# Altium schematic sheet Output_Distribution.SchDoc (part 2 of 3)
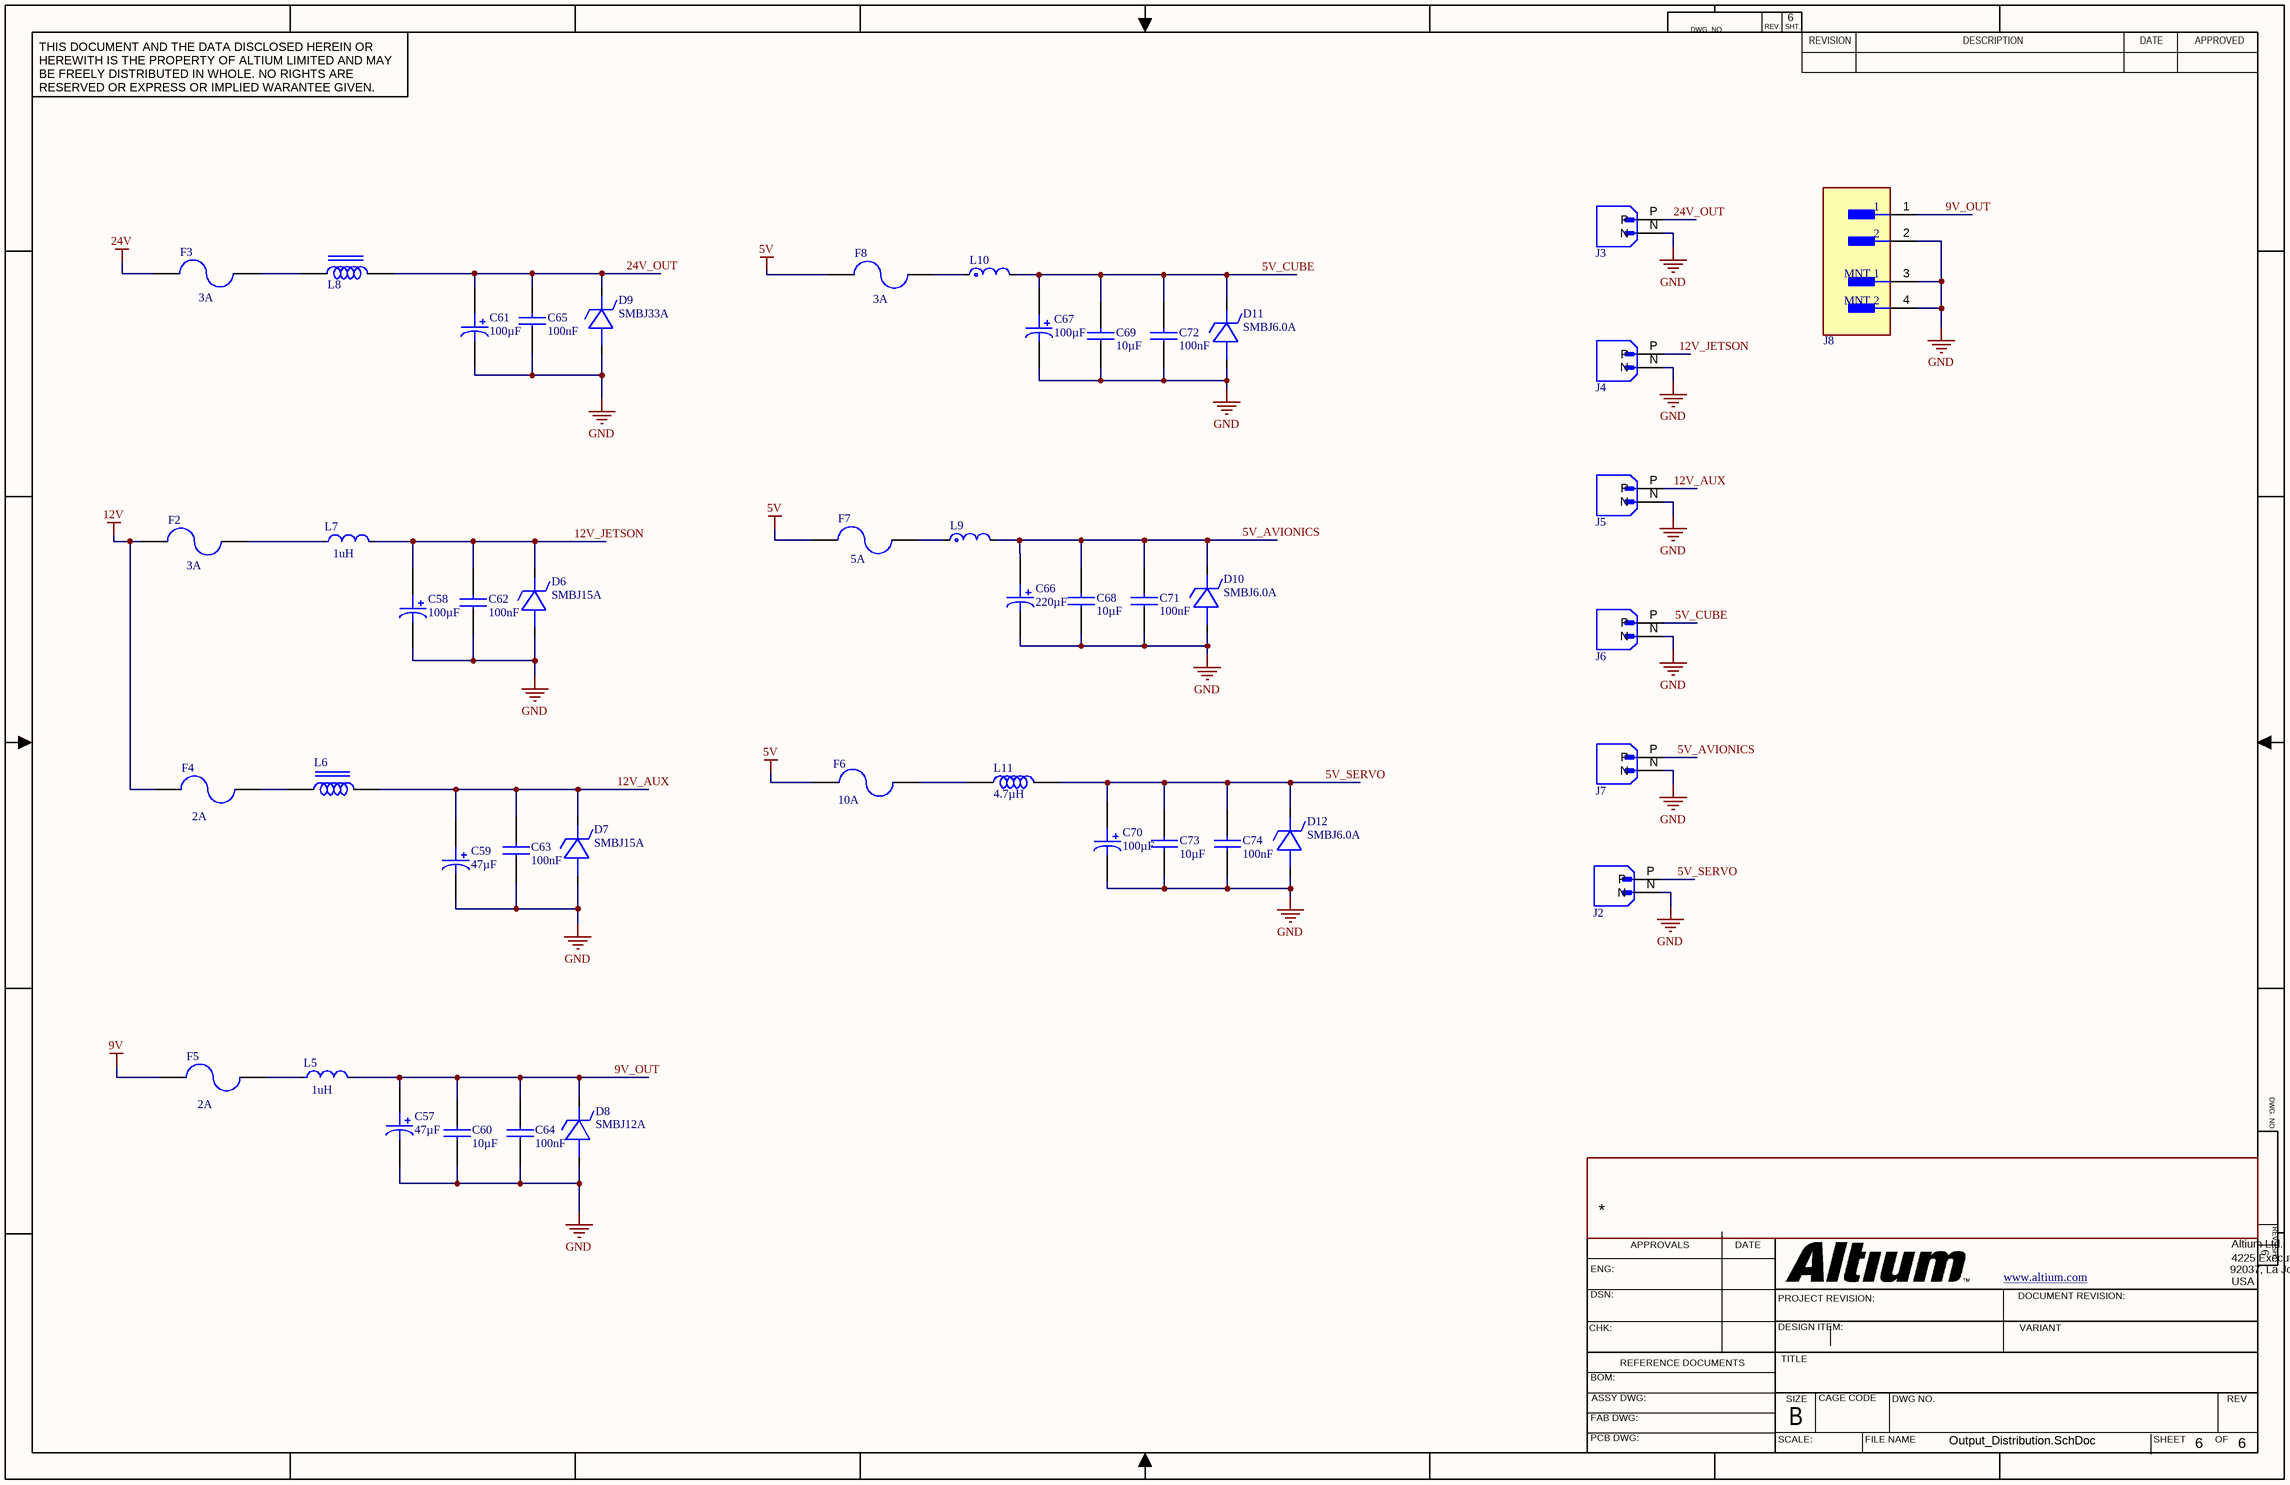
[diagram p1: Output_Distribution.SchDoc]
## Library data of the parts
C57 C59 = EEH-ZA1H470P: 47 µF 50 V Aluminum - Polymer Capacitors Radial, Can - SMD 30mOhm 10000 Hrs @ 105°C; Manufacturer: Panasonic; Manufacturer Lifecycle Status: ACTIVE; Part Series: ZA (High temp. reflow); ESR (Equivalent Series Resistance): 30mΩ; Leakage Current: 23.5µA; Life (Hours): 10000hours; Ripple Current: 1.8A; Tolerance: 20%; Voltage Rating: 50V; Case/Package: 3333; Category: Aluminum Electrolytic Capacitors; Country of Origin: Japan; Diameter: 8mm; Export Control Classification Number (ECCN) Code: EAR99; Harmonized Tariff Schedule (HTS) Code: 8532.22.00.20; Height: 10.2mm; Introduction Date: 2019-05-31; Length: 10.2mm; Lifecycle Status: Production; Manufacturer Part Number: EEH-ZA1H470P; Material: Polymer; Max Operating Temperature: 105°C; Min Operating Temperature: -55°C; Mounting Technology: Surface Mount; Number of Terminals: 2; Ratings: AEC-Q200; REACH SVHC: Yes; RoHS: Compliant; Voltage Rating (DC): 50V; Width: 8.3mm
C58 C61 C67 C70 = EEH-ZA1V101P: Conductive Polymer Hybrid Aluminum Electrolytic Capacitors, 100µF, 35V, -55 to 105¡C; Manufacturer: Panasonic; Manufacturer Lifecycle Status: ACTIVE; Part Series: ZA (High temp. reflow); ESR (Equivalent Series Resistance): 27mΩ; Leakage Current: 35µA; Life (Hours): 10000hours; Ripple Current: 2.3A; Tolerance: 20%; Supplier: Future Electronics; Supplier Part Number: EEH-ZA1V101P; Manufacturer Part Number: EEH-ZA1V101P; RoHS: Compliant; Category: Polymer Capacitors; Stock: 1000; Pricing: 500=0,335, 1000=0,33, 1500=0,325, 5000=0,315 (USD); ComponentLink1URL: https://datasheet.octopart.com:443/EEH-ZA1V101P-Panasonic-datasheet-136612405.pdf?src-supplier=Electro+Sonic; ComponentLink1Description: https://datasheet.octopart.com:443/EEH-ZA1V101P-Panasonic-datasheet-136612405.pdf?src-supplier=Electro+Sonic; ComponentLink2URL: https://datasheet.octopart.com:443/EEH-ZA1V101P-Panasonic-datasheet-154840537.pdf?src-supplier=Electro+Sonic; ComponentLink2Description: https://datasheet.octopart.com:443/EEH-ZA1V101P-Panasonic-datasheet-154840537.pdf?src-supplier=Electro+Sonic; ComponentLink3URL: https://datasheet.octopart.com:443/EEH-ZA1V101P-Panasonic-datasheet-68301292.pdf?src-supplier=Future+Electronics; ComponentLink3Description: https://datasheet.octopart.com:443/EEH-ZA1V101P-Panasonic-datasheet-68301292.pdf?src-supplier=Future+Electronics; Case/Package: 3333; Country of Origin: Japan; Diameter: 8mm; Export Control Classification Number (ECCN) Code: EAR99; Height: 10.2mm; Harmonized Tariff Schedule (HTS) Code: 8532.22.00.20; Introduction Date: 2019-05-31; Length: 10.2mm; Lifecycle Status: Production; Material: Polymer; Max Operating Temperature: 105°C; Min Operating Temperature: -55°C; Mounting Technology: Surface Mount; Number of Terminals: 2; Ratings: AEC-Q200; REACH SVHC: Yes; Voltage Rating: 35V; Voltage Rating (DC): 35V; Width: 8.3mm; ComponentLink4URL: https://datasheet.octopart.com:443/EEHZA1V101P-Panasonic-datasheet-68301292.pdf?src-supplier=Panasonic; ComponentLink4Description: https://datasheet.octopart.com:443/EEHZA1V101P-Panasonic-datasheet-68301292.pdf?src-supplier=Panasonic; ComponentLink5URL: https://datasheet.octopart.com:443/EEHZA1V101P-Panasonic-datasheet-137675046.pdf?src-supplier=TME; ComponentLink5Description: https://datasheet.octopart.com:443/EEHZA1V101P-Panasonic-datasheet-137675046.pdf?src-supplier=TME
C60 C68 C69 C73 = CL32A106KBJNNNE: 50V 10uF X5R 卤10% 1210 Multilayer Ceramic Capacitors MLCC - SMD/SMT ROHS; Manufacturer: Samsung Electro-Mechanics; Manufacturer Package Identifier: 1210 (3225 Metric); Tolerance: 10%; Supplier: Future Electronics; Supplier Part Number: CL32A106KBJNNNE; Manufacturer Part Number: CL32A106KBJNNNE; RoHS: Compliant; Category: Ceramic Capacitors; Stock: 186000; Pricing: 1000=0,11, 3000=0,107, 10000=0,105, 15000=0,103 (USD); Case/Package: 1210; Case Code (Imperial): 1210; Case Code (Metric): 3225; China RoHS: Compliant; Country of Origin: Mainland China, Philippines, South Korea; Depth: 2.5mm; Dielectric: X5R; Dielectric Material: Ceramic; Export Control Classification Number (ECCN) Code: EAR99; Height: 2.5mm; Harmonized Tariff Schedule (HTS) Code: 8532.24.00.20; Introduction Date: 2012-02-17; Lead Free: Lead Free; Length: 3.2mm; Lifecycle Status: Production; Material: Ceramic; Max Operating Temperature: 85°C; Min Operating Temperature: -55°C; Mounting Technology: Surface Mount; Number of Terminals: 2; Packaging: Tape & Reel (TR); REACH SVHC: Yes; Schedule B: 8532240020, 8532240020|8532240020|8532240020|8532240020|8532240020|8532240020|8532240020|8532240020|8532240020|8532240020|8532240020|8532240020|8532240020|8532240020|8532240020|8532240020|8532240020|8532240020|8532240020|8532240020|8532240020|8532240020|8532240020|85; Thickness: 2.6924mm; Voltage Rating: 50V; Voltage Rating (DC): 50V; Width: 2.5mm; ComponentLink1URL: https://datasheet.octopart.com:443/CL32A106KBJNNNE-Samsung-Electro-Mechanics-datasheet-141348239.pdf?src-supplier=Newark; ComponentLink1Description: https://datasheet.octopart.com:443/CL32A106KBJNNNE-Samsung-Electro-Mechanics-datasheet-141348239.pdf?src-supplier=Newark; ComponentLink2URL: https://datasheet.octopart.com:443/CL32A106KBJNNNE-Samsung-Electro-Mechanics-datasheet-136482658.pdf?src-supplier=Newark; ComponentLink2Description: https://datasheet.octopart.com:443/CL32A106KBJNNNE-Samsung-Electro-Mechanics-datasheet-136482658.pdf?src-supplier=Newark; ComponentLink3URL: https://datasheet.octopart.com:443/CL32A106KBJNNNE-Samsung-Electro-Mechanics-datasheet-149047602.pdf?src-supplier=Future+Electronics; ComponentLink3Description: https://datasheet.octopart.com:443/CL32A106KBJNNNE-Samsung-Electro-Mechanics-datasheet-149047602.pdf?src-supplier=Future+Electronics; ComponentLink4URL: https://datasheet.octopart.com:443/CL32A106KBJNNNE-Samsung-Electro-Mechanics-datasheet-67210002.pdf?src-supplier=Future+Electronics; ComponentLink4Description: https://datasheet.octopart.com:443/CL32A106KBJNNNE-Samsung-Electro-Mechanics-datasheet-67210002.pdf?src-supplier=Future+Electronics; ComponentLink5URL: https://datasheet.octopart.com:443/CL32A106KBJNNNE-Samsung-datasheet-58577986.pdf?src-supplier=Future+Electronics; ComponentLink5Description: https://datasheet.octopart.com:443/CL32A106KBJNNNE-Samsung-datasheet-58577986.pdf?src-supplier=Future+Electronics; ComponentLink6URL: https://datasheet.octopart.com:443/CL32A106KBJNNNE-Samsung-datasheet-37081328.pdf?src-supplier=Future+Electronics; ComponentLink6Description: https://datasheet.octopart.com:443/CL32A106KBJNNNE-Samsung-datasheet-37081328.pdf?src-supplier=Future+Electronics; ComponentLink7URL: https://datasheet.octopart.com/CL32A106KBJNNNE-Samsung-Electro-Mechanics-datasheet-97040617.pdf; ComponentLink7Description: https://datasheet.octopart.com/CL32A106KBJNNNE-Samsung-Electro-Mechanics-datasheet-97040617.pdf; ComponentLink8URL: https://datasheet.octopart.com/CL32A106KBJNNNE-Samsung-Electro-Mechanics-datasheet-8324245.pdf; ComponentLink8Description: https://datasheet.octopart.com/CL32A106KBJNNNE-Samsung-Electro-Mechanics-datasheet-8324245.pdf; ComponentLink9URL: https://datasheet.octopart.com:443/CL32A106KBJNNNE-Samsung-datasheet-8326407.pdf?src-supplier=TME; ComponentLink9Description: https://datasheet.octopart.com:443/CL32A106KBJNNNE-Samsung-datasheet-8326407.pdf?src-supplier=TME
C62-C65 C71 C72 C74 = CGA3E2X7R1H104K080AA: CGA Series 0603 100 nF 50 V ±10 % Tolerance X7R SMT Multilayer Ceramic Capacitor; Manufacturer: TDK; Manufacturer Lifecycle Status: PRODUCTION; Tolerance: 10%; Voltage: 50V; Supplier: Farnell; Supplier Part Number: CGA3E2X7R1H104K080AA; Manufacturer Part Number: CGA3E2X7R1H104K080AA; RoHS: Compliant; Category: Ceramic Capacitors; Stock: 155038; Pricing: 10=0,0336, 100=0,0286, 500=0,0215, 1000=0,0184, 2000=0,0173 (EUR); Case/Package: 0603; Case Code (Imperial): 0603; Case Code (Metric): 1608; China RoHS: Compliant; Composition: Ceramic; Depth: 800µm; Dielectric: X7R; Dielectric Material: Ceramic; Height: 800µm; Lead Free: Lead Free; Length: 1.6mm; Lifecycle Status: Production; Material: Ceramic; Max Length: 1.7mm; Max Operating Temperature: 125°C; Max Width: 900µm; Min Length: 1.5mm; Min Operating Temperature: -55°C; Min Width: 700µm; Mounting Technology: Surface Mount; Number of Terminals: 2; Radiation Hardening: No; Ratings: AEC-Q200; REACH SVHC: Yes; Schedule B: 8532240020, 8532240020|8532240020|8532240020|8532240020|8532240020; Termination: SMD/SMT; Thickness: 889µm; Voltage Rating: 50V; Voltage Rating (DC): 50V; Weight: 2.012816mg; Width: 800µm; ComponentLink1URL: https://datasheet.octopart.com:443/CGA3E2X7R1H104K080AA-TDK-datasheet-165583812.pdf?src-supplier=IHS; ComponentLink1Description: https://datasheet.octopart.com:443/CGA3E2X7R1H104K080AA-TDK-datasheet-165583812.pdf?src-supplier=IHS; ComponentLink2URL: https://datasheet.octopart.com:443/CGA3E2X7R1H104K080AA-TDK-datasheet-138890726.pdf?src-supplier=Upverter; ComponentLink2Description: https://datasheet.octopart.com:443/CGA3E2X7R1H104K080AA-TDK-datasheet-138890726.pdf?src-supplier=Upverter; ComponentLink3URL: https://datasheet.octopart.com:443/CGA3E2X7R1H104K080AA-TDK-datasheet-43457115.pdf?src-supplier=Upverter; ComponentLink3Description: https://datasheet.octopart.com:443/CGA3E2X7R1H104K080AA-TDK-datasheet-43457115.pdf?src-supplier=Upverter; ComponentLink4URL: https://datasheet.octopart.com:443/CGA3E2X7R1H104K080AA-TDK-datasheet-151546526.pdf?src-supplier=ODG+(Origin+Data+Global); ComponentLink4Description: https://datasheet.octopart.com:443/CGA3E2X7R1H104K080AA-TDK-datasheet-151546526.pdf?src-supplier=ODG+(Origin+Data+Global); ComponentLink5URL: https://datasheet.octopart.com:443/CGA3E2X7R1H104K080AA-TDK-datasheet-43366117.pdf?src-supplier=Newark; ComponentLink5Description: https://datasheet.octopart.com:443/CGA3E2X7R1H104K080AA-TDK-datasheet-43366117.pdf?src-supplier=Newark; ComponentLink6URL: https://datasheet.octopart.com:443/CGA3E2X7R1H104K080AA-TDK-datasheet-23766614.pdf?src-supplier=Newark; ComponentLink6Description: https://datasheet.octopart.com:443/CGA3E2X7R1H104K080AA-TDK-datasheet-23766614.pdf?src-supplier=Newark; ComponentLink7URL: https://datasheet.octopart.com:443/CGA3E2X7R1H104K080AA-TDK-datasheet-13444418.pdf?src-supplier=Newark; ComponentLink7Description: https://datasheet.octopart.com:443/CGA3E2X7R1H104K080AA-TDK-datasheet-13444418.pdf?src-supplier=Newark; ComponentLink8URL: https://datasheet.octopart.com:443/CGA3E2X7R1H104K080AA.-TDK-datasheet-159510193.pdf?src-supplier=Newark; ComponentLink8Description: https://datasheet.octopart.com:443/CGA3E2X7R1H104K080AA.-TDK-datasheet-159510193.pdf?src-supplier=Newark; ComponentLink9URL: https://datasheet.octopart.com:443/CGA3E2X7R1H104K080AA-TDK-datasheet-136412745.pdf?src-supplier=element14+APAC; ComponentLink9Description: https://datasheet.octopart.com:443/CGA3E2X7R1H104K080AA-TDK-datasheet-136412745.pdf?src-supplier=element14+APAC; ComponentLink10URL: https://datasheet.octopart.com:443/CGA3E2X7R1H104K080AA-TDK-datasheet-21217900.pdf?src-supplier=Farnell; ComponentLink10Description: https://datasheet.octopart.com:443/CGA3E2X7R1H104K080AA-TDK-datasheet-21217900.pdf?src-supplier=Farnell; ComponentLink11URL: https://datasheet.octopart.com:443/CGA3E2X7R1H104K080AA-TDK-datasheet-164882302.pdf?src-supplier=Burklin+Elektronik; ComponentLink11Description: https://datasheet.octopart.com:443/CGA3E2X7R1H104K080AA-TDK-datasheet-164882302.pdf?src-supplier=Burklin+Elektronik; ComponentLink12URL: https://datasheet.octopart.com:443/CGA3E2X7R1H104K080AA-TDK-datasheet-13234200.pdf?src-supplier=Future+Electronics; ComponentLink12Description: https://datasheet.octopart.com:443/CGA3E2X7R1H104K080AA-TDK-datasheet-13234200.pdf?src-supplier=Future+Electronics; ComponentLink13URL: https://datasheet.octopart.com:443/CGA3E2X7R1H104K080AA-TDK-datasheet-12527010.pdf?src-supplier=Future+Electronics; ComponentLink13Description: https://datasheet.octopart.com:443/CGA3E2X7R1H104K080AA-TDK-datasheet-12527010.pdf?src-supplier=Future+Electronics; ComponentLink14URL: https://datasheet.octopart.com:443/CGA3E2X7R1H104K080AA-TDK-datasheet-140571036.pdf?src-supplier=Arrow.cn; ComponentLink14Description: https://datasheet.octopart.com:443/CGA3E2X7R1H104K080AA-TDK-datasheet-140571036.pdf?src-supplier=Arrow.cn
C66 = EEHZA1A221P: SMD Polymer Hybrid Aluminum Electrolytic Capacitor, 220uF, 25V, 20%; Manufacturer: Panasonic; Manufacturer Part Number: EEHZA1E221P; Manufacturer Lifecycle Status: ACTIVE; Part Series: ZA (High temp. reflow); Dissipation Factor: 14%; ESR (Equivalent Series Resistance): 27mΩ; Lead Diameter: 900µm; Leakage Current: 55µA; Life (Hours): 10000hours; Ripple Current: 2.3A; Supplier: Farnell; Supplier Part Number: EEHZA1E221P; RoHS: Compliant; Category: Aluminum Electrolytic Capacitors; Stock: 500; Pricing: 500=0,529 (EUR); Case/Package: 3333; Country of Origin: Japan; Diameter: 8mm; Export Control Classification Number (ECCN) Code: EAR99; Height: 10.2mm; Height - Seated (Max): 10.4902mm; Harmonized Tariff Schedule (HTS) Code: 8532.22.00.20; Introduction Date: 2012-02-01; Lead Free: Lead Free; Lead Pitch: 3.1mm; Length: 10.2mm; Lifecycle Status: Production; Material: Polymer; Max Operating Temperature: 105°C; Min Operating Temperature: -55°C; Mounting Technology: Surface Mount; Number of Terminals: 2; Packaging: Cut Tape; Radiation Hardening: No; Ratings: AEC-Q200; REACH SVHC: Yes; Ripple Current (AC): 2.3A; Schedule B: 8532220020, 8532220020|8532220020|8532220020|8532220020|8532220020; Termination: SMD/SMT; Tolerance: 20%; Voltage: 25V; Voltage Rating: 25V; Voltage Rating (DC): 25V; Width: 8.3mm; ComponentLink1URL: https://datasheet.octopart.com:443/EEHZA1E221P-Panasonic-datasheet-182101003.pdf?src-supplier=IHS; ComponentLink1Description: https://datasheet.octopart.com:443/EEHZA1E221P-Panasonic-datasheet-182101003.pdf?src-supplier=IHS; ComponentLink2URL: https://datasheet.octopart.com:443/EEHZA1E221P-Panasonic-datasheet-68301292.pdf?src-supplier=ODG+(Origin+Data+Global); ComponentLink2Description: https://datasheet.octopart.com:443/EEHZA1E221P-Panasonic-datasheet-68301292.pdf?src-supplier=ODG+(Origin+Data+Global); ComponentLink3URL: https://datasheet.octopart.com:443/EEHZA1E221P-Panasonic-datasheet-10883188.pdf?src-supplier=Electro+Sonic; ComponentLink3Description: https://datasheet.octopart.com:443/EEHZA1E221P-Panasonic-datasheet-10883188.pdf?src-supplier=Electro+Sonic; ComponentLink4URL: https://datasheet.octopart.com:443/EEH-ZA1E221P-Panasonic-datasheet-16044608.pdf?src-supplier=Electro+Sonic; ComponentLink4Description: https://datasheet.octopart.com:443/EEH-ZA1E221P-Panasonic-datasheet-16044608.pdf?src-supplier=Electro+Sonic; ComponentLink5URL: https://datasheet.octopart.com:443/EEH-ZA1E221P-Panasonic-datasheet-41972975.pdf?src-supplier=Electro+Sonic; ComponentLink5Description: https://datasheet.octopart.com:443/EEH-ZA1E221P-Panasonic-datasheet-41972975.pdf?src-supplier=Electro+Sonic; ComponentLink6URL: https://datasheet.octopart.com:443/EEH-ZA1E221P-Panasonic-datasheet-41178975.pdf?src-supplier=Electro+Sonic; ComponentLink6Description: https://datasheet.octopart.com:443/EEH-ZA1E221P-Panasonic-datasheet-41178975.pdf?src-supplier=Electro+Sonic; ComponentLink7URL: https://datasheet.octopart.com:443/EEH-ZA1E221P-Panasonic-datasheet-154766140.pdf?src-supplier=JRH+Electronics; ComponentLink7Description: https://datasheet.octopart.com:443/EEH-ZA1E221P-Panasonic-datasheet-154766140.pdf?src-supplier=JRH+Electronics; ComponentLink8URL: https://datasheet.octopart.com:443/EEHZA1E221P-Panasonic-datasheet-136612405.pdf?src-supplier=Farnell; ComponentLink8Description: https://datasheet.octopart.com:443/EEHZA1E221P-Panasonic-datasheet-136612405.pdf?src-supplier=Farnell; ComponentLink9URL: https://datasheet.octopart.com:443/EEHZA1E221P-Panasonic-datasheet-102492116.pdf?src-supplier=Newark; ComponentLink9Description: https://datasheet.octopart.com:443/EEHZA1E221P-Panasonic-datasheet-102492116.pdf?src-supplier=Newark; ComponentLink10URL: https://datasheet.octopart.com:443/EEHZA1E221P-Panasonic-datasheet-61627650.pdf?src-supplier=Newark; ComponentLink10Description: https://datasheet.octopart.com:443/EEHZA1E221P-Panasonic-datasheet-61627650.pdf?src-supplier=Newark; ComponentLink11URL: https://datasheet.octopart.com:443/EEHZA1E221P-Panasonic-datasheet-137675046.pdf?src-supplier=TME; ComponentLink11Description: https://datasheet.octopart.com:443/EEHZA1E221P-Panasonic-datasheet-137675046.pdf?src-supplier=TME; ComponentLink12URL: https://datasheet.octopart.com:443/EEH-ZA1E221P-Panasonic-datasheet-23757480.pdf?src-supplier=RS+(Formerly+Allied+Electronics); ComponentLink12Description: https://datasheet.octopart.com:443/EEH-ZA1E221P-Panasonic-datasheet-23757480.pdf?src-supplier=RS+(Formerly+Allied+Electronics)
D6 D7 = SMBJ15A: TVS Diode, SMBJ, Unidirectional, 15 V, 24.4 V, DO-214AA (SMB), 2 Pins; Manufacturer: Bourns; Breakdown Voltage: 17.6V; Clamping Voltage: 24.4V; Element Configuration: Single; ESD Protection: Yes; Leakage Current: 5µA; Max Breakdown Voltage: 18.5V; Max Junction Temperature (Tj): 150°C; Max Power Dissipation: 5W; Max Surge Current: 100A; Min Breakdown Voltage: 16.7V; Number of Channels: 1; Peak Pulse Current: 24.6A; Peak Pulse Power: 600W; Power Line Protection: No; Reverse Standoff Voltage: 15V; Test Current: 1mA; Supplier: Arrow Electronics; Supplier Part Number: SMBJ15A; Manufacturer Part Number: SMBJ15A; RoHS: Compliant; Category: TVS Diodes; Stock: 36000; Pricing: 3000=0,0852 (USD); Case/Package: SMB; China RoHS: Non-Compliant; Composition: Zener; Country of Origin: Taiwan; Direction: Unidirectional; Export Control Classification Number (ECCN) Code: EAR99; Height: 2.44mm; Harmonized Tariff Schedule (HTS) Code: 8541.10.00.50; Introduction Date: 2010-02-23; Length: 4.57mm; Lifecycle Status: Production; Max Operating Temperature: 150°C; Max Reverse Leakage Current: 5µA; Min Operating Temperature: -55°C; Mounting Technology: Surface Mount; Number of Elements: 1; Pins: 2; Number of Terminals: 2; Number of Unidirectional Channels: 1; Packaging: Tape & Reel; Polarity: Unidirectional; Power Rating: 600W; Radiation Hardening: No; REACH SVHC: No; Reverse Breakdown Voltage: 16.7V; Schedule B: 8541100080; Termination: SMD/SMT; Width: 3.94mm; ComponentLink1URL: https://datasheet.octopart.com:443/SMBJ15A-Bourns-datasheet-179980059.pdf?src-supplier=TME; ComponentLink1Description: https://datasheet.octopart.com:443/SMBJ15A-Bourns-datasheet-179980059.pdf?src-supplier=TME; ComponentLink2URL: https://datasheet.octopart.com:443/SMBJ15A-Bourns-datasheet-12567566.pdf?src-supplier=Burklin+Elektronik; ComponentLink2Description: https://datasheet.octopart.com:443/SMBJ15A-Bourns-datasheet-12567566.pdf?src-supplier=Burklin+Elektronik; ComponentLink3URL: https://datasheet.octopart.com:443/SMBJ15A-Bourns-datasheet-165058450.pdf?src-supplier=Burklin+Elektronik; ComponentLink3Description: https://datasheet.octopart.com:443/SMBJ15A-Bourns-datasheet-165058450.pdf?src-supplier=Burklin+Elektronik; ComponentLink4URL: https://datasheet.octopart.com:443/SMBJ15A-Bourns-datasheet-94099898.pdf?src-supplier=element14+APAC; ComponentLink4Description: https://datasheet.octopart.com:443/SMBJ15A-Bourns-datasheet-94099898.pdf?src-supplier=element14+APAC; ComponentLink5URL: https://datasheet.octopart.com:443/SMBJ15A-Bourns-datasheet-34433208.pdf?src-supplier=Newark; ComponentLink5Description: https://datasheet.octopart.com:443/SMBJ15A-Bourns-datasheet-34433208.pdf?src-supplier=Newark; ComponentLink6URL: https://datasheet.octopart.com:443/SMBJ15A-Bourns-datasheet-154729896.pdf?src-supplier=Electro+Sonic; ComponentLink6Description: https://datasheet.octopart.com:443/SMBJ15A-Bourns-datasheet-154729896.pdf?src-supplier=Electro+Sonic; ComponentLink7URL: https://datasheet.octopart.com:443/SMBJ15A-Bourns-datasheet-10292148.pdf?src-supplier=element14; ComponentLink7Description: https://datasheet.octopart.com:443/SMBJ15A-Bourns-datasheet-10292148.pdf?src-supplier=element14; ComponentLink8URL: https://datasheet.octopart.com:443/SMBJ15A-Bourns-datasheet-42429174.pdf?src-supplier=RS+(Formerly+Allied+Electronics); ComponentLink8Description: https://datasheet.octopart.com:443/SMBJ15A-Bourns-datasheet-42429174.pdf?src-supplier=RS+(Formerly+Allied+Electronics); ComponentLink9URL: https://datasheet.octopart.com:443/SMBJ15A-Bourns-datasheet-14047909.pdf?src-supplier=iiiC; ComponentLink9Description: https://datasheet.octopart.com:443/SMBJ15A-Bourns-datasheet-14047909.pdf?src-supplier=iiiC; ComponentLink10URL: http://sigma.octopart.com:80/conflict_mineral_statement/Bourns-company-36.pdf?src-supplier=Compliance+Statements; ComponentLink10Description: http://sigma.octopart.com:80/conflict_mineral_statement/Bourns-company-36.pdf?src-supplier=Compliance+Statements
D8 = SMBJ12A: SMBJ Series 19.9 V 0.6 kW Surface Mount Uni-Directional TVS Diode - DO-214AA; Manufacturer: Littelfuse; Breakdown Voltage: 14V; Clamping Voltage: 19.9V; Direction: Unidirectional; Element Configuration: Single; ESD Protection: Yes; Forward Voltage: 3.5V; Leakage Current: 1µA; Max Breakdown Voltage: 14.7V; Max Junction Temperature (Tj): 150°C; Max Power Dissipation: 5W; Max Surge Current: 30.2A; Min Breakdown Voltage: 13.3V; Number of Channels: 1; Operating Supply Voltage: 12V; Peak Pulse Power: 600W; Power Line Protection: No; Test Current: 1mA; Supplier: Farnell; Supplier Part Number: SMBJ12A; Manufacturer Part Number: SMBJ12A; RoHS: Compliant; Category: TVS Diodes; Stock: 3078; Pricing: 5=0,285, 10=0,191, 100=0,168, 500=0,145, 1000=0,122, 5000=0,0993 (EUR); Case/Package: SMB; China RoHS: Non-Compliant; Composition: Zener; Country of Origin: Mainland China, Philippines; Export Control Classification Number (ECCN) Code: EAR99; Height: 2.61mm; Harmonized Tariff Schedule (HTS) Code: 8541.10.00.50; Introduction Date: 1996-01-01; Lead Free: Lead Free; Length: 4.5466mm; Lifecycle Status: Production; Max Operating Temperature: 150°C; Max Reverse Leakage Current: 1µA; Min Operating Temperature: -65°C; Mounting Technology: Surface Mount; Number of Elements: 1; Pins: 2; Number of Terminals: 2; Number of Unidirectional Channels: 1; Packaging: Cut Tape; Peak Pulse Current: 30.2A; Peak Reverse Current: 1µA; Polarity: Unidirectional; Power Rating: 600W; Radiation Hardening: No; REACH SVHC: No; Reverse Breakdown Voltage: 13.3V; Reverse Standoff Voltage: 12V; Reverse Voltage: 12V; Schedule B: 8541100080, 8541100080|8541100080|8541100080|8541100080|8541100080|8541100080|8541100080|8541100080|8541100080|8541100080|8541100080|8541100080|8541100080|8541100080|8541100080|8541100080|8541100080|8541100080|8541100080|8541100080|8541100080|8541100080|8541100080|85; Termination: SMD/SMT; Voltage Rating (DC): 12V; Width: 3.937mm; ComponentLink1URL: https://datasheet.octopart.com:443/SMBJ12A-Littelfuse-datasheet-180609570.pdf?src-supplier=IHS; ComponentLink1Description: https://datasheet.octopart.com:443/SMBJ12A-Littelfuse-datasheet-180609570.pdf?src-supplier=IHS; ComponentLink2URL: https://datasheet.octopart.com:443/SMBJ12A-Littelfuse-datasheet-98958142.pdf?src-supplier=Burklin+Elektronik; ComponentLink2Description: https://datasheet.octopart.com:443/SMBJ12A-Littelfuse-datasheet-98958142.pdf?src-supplier=Burklin+Elektronik; ComponentLink3URL: https://datasheet.octopart.com:443/SMBJ12A-Littelfuse-datasheet-46975802.pdf?src-supplier=Burklin+Elektronik; ComponentLink3Description: https://datasheet.octopart.com:443/SMBJ12A-Littelfuse-datasheet-46975802.pdf?src-supplier=Burklin+Elektronik; ComponentLink4URL: https://datasheet.octopart.com:443/SMBJ12A-Littelfuse-datasheet-10854588.pdf?src-supplier=element14+APAC; ComponentLink4Description: https://datasheet.octopart.com:443/SMBJ12A-Littelfuse-datasheet-10854588.pdf?src-supplier=element14+APAC; ComponentLink5URL: https://datasheet.octopart.com:443/SMBJ12A-Littelfuse-datasheet-63710821.pdf?src-supplier=element14+APAC; ComponentLink5Description: https://datasheet.octopart.com:443/SMBJ12A-Littelfuse-datasheet-63710821.pdf?src-supplier=element14+APAC; ComponentLink6URL: https://datasheet.octopart.com:443/SMBJ12A-Littelfuse-datasheet-5319440.pdf?src-supplier=element14+APAC; ComponentLink6Description: https://datasheet.octopart.com:443/SMBJ12A-Littelfuse-datasheet-5319440.pdf?src-supplier=element14+APAC; ComponentLink7URL: https://datasheet.octopart.com:443/SMBJ12A-Littelfuse-datasheet-145017494.pdf?src-supplier=Farnell; ComponentLink7Description: https://datasheet.octopart.com:443/SMBJ12A-Littelfuse-datasheet-145017494.pdf?src-supplier=Farnell; ComponentLink8URL: https://datasheet.octopart.com:443/SMBJ12A-Littelfuse-datasheet-123574.pdf?src-supplier=Farnell; ComponentLink8Description: https://datasheet.octopart.com:443/SMBJ12A-Littelfuse-datasheet-123574.pdf?src-supplier=Farnell; ComponentLink9URL: https://datasheet.octopart.com:443/SMBJ12A-Littelfuse-datasheet-871.pdf?src-supplier=DigiKey; ComponentLink9Description: https://datasheet.octopart.com:443/SMBJ12A-Littelfuse-datasheet-871.pdf?src-supplier=DigiKey; ComponentLink10URL: https://datasheet.octopart.com:443/SMBJ12A-Littelfuse-datasheet-170904961.pdf?src-supplier=Future+Electronics; ComponentLink10Description: https://datasheet.octopart.com:443/SMBJ12A-Littelfuse-datasheet-170904961.pdf?src-supplier=Future+Electronics; ComponentLink11URL: https://datasheet.octopart.com:443/SMBJ12A-Littelfuse-datasheet-27889791.pdf?src-supplier=Fuses+Unlimited; ComponentLink11Description: https://datasheet.octopart.com:443/SMBJ12A-Littelfuse-datasheet-27889791.pdf?src-supplier=Fuses+Unlimited; ComponentLink12URL: https://datasheet.octopart.com:443/SMBJ12A-Littelfuse-datasheet-9813940.pdf?src-supplier=RS+(Formerly+Allied+Electronics); ComponentLink12Description: https://datasheet.octopart.com:443/SMBJ12A-Littelfuse-datasheet-9813940.pdf?src-supplier=RS+(Formerly+Allied+Electronics); ComponentLink13URL: https://datasheet.octopart.com:443/SMBJ12A-Littelfuse-datasheet-22888.pdf?src-supplier=RS+(Formerly+Allied+Electronics); ComponentLink13Description: https://datasheet.octopart.com:443/SMBJ12A-Littelfuse-datasheet-22888.pdf?src-supplier=RS+(Formerly+Allied+Electronics); ComponentLink14URL: https://datasheet.octopart.com:443/SMBJ12A-Littelfuse-datasheet-10521649.pdf?src-supplier=Jameco; ComponentLink14Description: https://datasheet.octopart.com:443/SMBJ12A-Littelfuse-datasheet-10521649.pdf?src-supplier=Jameco; ComponentLink15URL: https://datasheet.octopart.com:443/SMBJ12A-Littelfuse-datasheet-11045459.pdf?src-supplier=Newark; ComponentLink15Description: https://datasheet.octopart.com:443/SMBJ12A-Littelfuse-datasheet-11045459.pdf?src-supplier=Newark
D9 = SMBJ33A: SMBJ Series 53.3 V 0.6 kW Surface Mount Uni-Directional TVS Diode - DO-214AA; Manufacturer: Littelfuse; Breakdown Voltage: 38.65V; Clamping Voltage: 53.3V; Direction: Unidirectional; Element Configuration: Single; Forward Voltage: 3.5V; Leakage Current: 1µA; Max Breakdown Voltage: 40.6V; Max Junction Temperature (Tj): 150°C; Max Power Dissipation: 5W; Max Surge Current: 11.3A; Min Breakdown Voltage: 36.7V; Number of Channels: 1; Operating Supply Voltage: 33V; Peak Pulse Power: 600W; Power Line Protection: No; Test Current: 1mA; Supplier: Farnell; Supplier Part Number: SMBJ33A; Manufacturer Part Number: SMBJ33A; RoHS: Compliant; Category: TVS Diodes; Stock: 4121; Pricing: 5=0,26, 10=0,175, 100=0,158, 500=0,14, 1000=0,123, 5000=0,105 (EUR); Case/Package: SMB; China RoHS: Non-Compliant; Composition: Zener; Country of Origin: Mainland China, Philippines; Export Control Classification Number (ECCN) Code: EAR99; Height: 2.61mm; Harmonized Tariff Schedule (HTS) Code: 8541.10.00.50; Introduction Date: 1996-01-01; Lead Free: Lead Free; Length: 4.57mm; Lifecycle Status: Production; Max Operating Temperature: 150°C; Max Reverse Leakage Current: 1µA; Min Operating Temperature: -65°C; Mounting Technology: Surface Mount; Number of Elements: 1; Pins: 2; Number of Terminals: 2; Number of Unidirectional Channels: 1; Packaging: Tape & Reel; Peak Pulse Current: 11.3A; Peak Reverse Current: 1µA; Polarity: Unidirectional; Power Rating: 600W; Radiation Hardening: No; REACH SVHC: No; Reverse Breakdown Voltage: 36.7V; Reverse Standoff Voltage: 33V; Reverse Voltage: 33V; Schedule B: 8541100080, 8541100080|8541100080|8541100080|8541100080|8541100080|8541100080|8541100080|8541100080|8541100080|8541100080|8541100080|8541100080|8541100080|8541100080|8541100080|8541100080|8541100080|8541100080|8541100080|8541100080|8541100080|8541100080|8541100080|85; Termination: SMD/SMT; Voltage Rating (DC): 33V; Width: 3.94mm; ComponentLink1URL: https://datasheet.octopart.com:443/SMBJ33A-Littelfuse-datasheet-180609570.pdf?src-supplier=IHS; ComponentLink1Description: https://datasheet.octopart.com:443/SMBJ33A-Littelfuse-datasheet-180609570.pdf?src-supplier=IHS; ComponentLink2URL: https://datasheet.octopart.com:443/SMBJ33A-Littelfuse-datasheet-98958142.pdf?src-supplier=Littelfuse+SCT; ComponentLink2Description: https://datasheet.octopart.com:443/SMBJ33A-Littelfuse-datasheet-98958142.pdf?src-supplier=Littelfuse+SCT; ComponentLink3URL: https://datasheet.octopart.com:443/SMBJ33A-Littelfuse-datasheet-10854588.pdf?src-supplier=element14+APAC; ComponentLink3Description: https://datasheet.octopart.com:443/SMBJ33A-Littelfuse-datasheet-10854588.pdf?src-supplier=element14+APAC; ComponentLink4URL: https://datasheet.octopart.com:443/SMBJ33A-Littelfuse-datasheet-5319440.pdf?src-supplier=element14+APAC; ComponentLink4Description: https://datasheet.octopart.com:443/SMBJ33A-Littelfuse-datasheet-5319440.pdf?src-supplier=element14+APAC; ComponentLink5URL: https://datasheet.octopart.com:443/SMBJ33A-Littelfuse-datasheet-145017494.pdf?src-supplier=Farnell; ComponentLink5Description: https://datasheet.octopart.com:443/SMBJ33A-Littelfuse-datasheet-145017494.pdf?src-supplier=Farnell; ComponentLink6URL: https://datasheet.octopart.com:443/SMBJ33A-Littelfuse-datasheet-63710821.pdf?src-supplier=Farnell; ComponentLink6Description: https://datasheet.octopart.com:443/SMBJ33A-Littelfuse-datasheet-63710821.pdf?src-supplier=Farnell; ComponentLink7URL: https://datasheet.octopart.com:443/SMBJ33A-Littelfuse-datasheet-170904961.pdf?src-supplier=Future+Electronics; ComponentLink7Description: https://datasheet.octopart.com:443/SMBJ33A-Littelfuse-datasheet-170904961.pdf?src-supplier=Future+Electronics; ComponentLink8URL: https://datasheet.octopart.com:443/SMBJ33A-Littelfuse-datasheet-27889791.pdf?src-supplier=Fuses+Unlimited; ComponentLink8Description: https://datasheet.octopart.com:443/SMBJ33A-Littelfuse-datasheet-27889791.pdf?src-supplier=Fuses+Unlimited; ComponentLink9URL: https://datasheet.octopart.com:443/SMBJ33A-Littelfuse-datasheet-871.pdf?src-supplier=DigiKey; ComponentLink9Description: https://datasheet.octopart.com:443/SMBJ33A-Littelfuse-datasheet-871.pdf?src-supplier=DigiKey
D10-D12 = SMBJ6.0A: SMBJ Series 10.3 V 0.6 kW Surface Mount Uni-Directional TVS Diode - DO-214AA; Manufacturer: Littelfuse; Breakdown Voltage: 7.02V; Clamping Voltage: 10.3V; Direction: Unidirectional; Element Configuration: Single; Forward Voltage: 3.5V; Leakage Current: 1µA; Max Breakdown Voltage: 7.37V; Max Junction Temperature (Tj): 150°C; Max Power Dissipation: 5W; Max Reverse Leakage Current: 800µA; Max Surge Current: 6.2A; Min Breakdown Voltage: 6.67V; Number of Channels: 1; Operating Supply Voltage: 60V; Peak Pulse Current: 58.3A; Peak Pulse Power: 600W; Power Line Protection: No; Reverse Breakdown Voltage: 66.7V; Reverse Standoff Voltage: 6V; Test Current: 10mA; Supplier: Farnell; Supplier Part Number: SMBJ6.0A; Manufacturer Part Number: SMBJ6.0A; RoHS: Compliant; Category: TVS Diodes; Stock: 3000; Pricing: 3000=0,127, 9000=0,111 (EUR); Case/Package: SMB; China RoHS: Non-Compliant; Composition: Zener; Height: 2.61mm; Lead Free: Lead Free; Length: 4.57mm; Lifecycle Status: Production; Max Operating Temperature: 150°C; Min Operating Temperature: -65°C; Mounting Technology: Surface Mount; Number of Elements: 1; Pins: 2; Number of Terminals: 2; Number of Unidirectional Channels: 1; Packaging: Tape & Reel; Peak Reverse Current: 800µA; Polarity: Unidirectional; Power Rating: 600W; Radiation Hardening: No; REACH SVHC: No; Reverse Voltage: 6V; Schedule B: 8541100080, 8541100080|8541100080|8541100080|8541100080|8541100080; Termination: SMD/SMT; Voltage Rating (DC): 6V; Width: 3.94mm; ComponentLink1URL: https://datasheet.octopart.com:443/SMBJ6.0A-Littelfuse-datasheet-180609570.pdf?src-supplier=IHS; ComponentLink1Description: https://datasheet.octopart.com:443/SMBJ6.0A-Littelfuse-datasheet-180609570.pdf?src-supplier=IHS; ComponentLink2URL: https://datasheet.octopart.com:443/SMBJ6.0A-Littelfuse-datasheet-98958142.pdf?src-supplier=Littelfuse+SCT; ComponentLink2Description: https://datasheet.octopart.com:443/SMBJ6.0A-Littelfuse-datasheet-98958142.pdf?src-supplier=Littelfuse+SCT; ComponentLink3URL: https://datasheet.octopart.com:443/SMBJ6.0A-Littelfuse-datasheet-10854588.pdf?src-supplier=TME; ComponentLink3Description: https://datasheet.octopart.com:443/SMBJ6.0A-Littelfuse-datasheet-10854588.pdf?src-supplier=TME; ComponentLink4URL: https://datasheet.octopart.com:443/SMBJ6.0A-Littelfuse-datasheet-123574.pdf?src-supplier=Farnell; ComponentLink4Description: https://datasheet.octopart.com:443/SMBJ6.0A-Littelfuse-datasheet-123574.pdf?src-supplier=Farnell; ComponentLink5URL: https://datasheet.octopart.com:443/SMBJ6.0A-Littelfuse-datasheet-63710821.pdf?src-supplier=Farnell; ComponentLink5Description: https://datasheet.octopart.com:443/SMBJ6.0A-Littelfuse-datasheet-63710821.pdf?src-supplier=Farnell; ComponentLink6URL: https://datasheet.octopart.com:443/SMBJ6.0A-Littelfuse-datasheet-145017494.pdf?src-supplier=element14+APAC; ComponentLink6Description: https://datasheet.octopart.com:443/SMBJ6.0A-Littelfuse-datasheet-145017494.pdf?src-supplier=element14+APAC; ComponentLink7URL: https://datasheet.octopart.com:443/SMBJ6.0A-Littelfuse-datasheet-165289144.pdf?src-supplier=Electro+Sonic; ComponentLink7Description: https://datasheet.octopart.com:443/SMBJ6.0A-Littelfuse-datasheet-165289144.pdf?src-supplier=Electro+Sonic; ComponentLink8URL: https://datasheet.octopart.com:443/SMBJ6.0A-Littelfuse-datasheet-27889791.pdf?src-supplier=Future+Electronics; ComponentLink8Description: https://datasheet.octopart.com:443/SMBJ6.0A-Littelfuse-datasheet-27889791.pdf?src-supplier=Future+Electronics; ComponentLink9URL: https://datasheet.octopart.com:443/SMBJ6.0A-Littelfuse-datasheet-5319440.pdf?src-supplier=Future+Electronics; ComponentLink9Description: https://datasheet.octopart.com:443/SMBJ6.0A-Littelfuse-datasheet-5319440.pdf?src-supplier=Future+Electronics; ComponentLink10URL: https://datasheet.octopart.com:443/SMBJ6.0A-Littelfuse-datasheet-11547152.pdf?src-supplier=Future+Electronics; ComponentLink10Description: https://datasheet.octopart.com:443/SMBJ6.0A-Littelfuse-datasheet-11547152.pdf?src-supplier=Future+Electronics; ComponentLink11URL: https://datasheet.octopart.com:443/SMBJ6.0A-Littelfuse-datasheet-5393952.pdf?src-supplier=Future+Electronics; ComponentLink11Description: https://datasheet.octopart.com:443/SMBJ6.0A-Littelfuse-datasheet-5393952.pdf?src-supplier=Future+Electronics; ComponentLink12URL: https://datasheet.octopart.com:443/SMBJ6.0A-Littelfuse-datasheet-511791.pdf?src-supplier=Future+Electronics; ComponentLink12Description: https://datasheet.octopart.com:443/SMBJ6.0A-Littelfuse-datasheet-511791.pdf?src-supplier=Future+Electronics; ComponentLink13URL: https://datasheet.octopart.com:443/SMBJ6.0A-Littelfuse-datasheet-871.pdf?src-supplier=DigiKey; ComponentLink13Description: https://datasheet.octopart.com:443/SMBJ6.0A-Littelfuse-datasheet-871.pdf?src-supplier=DigiKey; ComponentLink14URL: https://datasheet.octopart.com:443/SMBJ6.0A-Littelfuse-datasheet-22888.pdf?src-supplier=RS+(Formerly+Allied+Electronics); ComponentLink14Description: https://datasheet.octopart.com:443/SMBJ6.0A-Littelfuse-datasheet-22888.pdf?src-supplier=RS+(Formerly+Allied+Electronics)
F2 F3 F8 = Littelfuse 0452003.MRL: Fuse Chip Slow Blow Acting 3A 125V SMD Solder Pad 2410 Ceramic T/R CSA/PSE/UL; Approvals: CSA, PSE, UL, UR; Ratings: CE, CSA, TUV; Value: 34mΩ; Time to Trip: 2ms; Supplier: Farnell; Supplier Part Number: 0452003.MRL; Manufacturer: Littelfuse; Manufacturer Part Number: 0452003.MRL; RoHS: Compliant; Category: Fuses; Stock: 1599; Pricing: 1=2,43, 50=1,54, 100=1,45, 250=1,28, 500=1,24 (EUR); Body Material: Ceramic; Case/Package: SMD/SMT; China RoHS: Non-Compliant; Contact Plating: Gold; Country of Origin: Philippines; Depth: 2.69mm; Diameter: 2.69mm; Export Control Classification Number (ECCN) Code: EAR99; Fuse Current: 3A; Height: 2.69mm; Housing Material: Ceramic; Harmonized Tariff Schedule (HTS) Code: 8536.10.00.40; Introduction Date: 2005-07-31; Lead Free: Lead Free; Length: 6.1mm; Lifecycle Status: Production; Max Operating Temperature: 125°C; Min Operating Temperature: -55°C; Mounting Technology: Surface Mount; Pins: 2; Radiation Hardening: No; REACH SVHC: No; Terminal Material: Gold; Termination: SMD/SMT; Voltage Rating: 125V; Voltage Rating (AC): 125V; Voltage Rating (DC): 125V; Width: 2.69mm; Working Voltage: 125V; ComponentLink1URL: https://datasheet.octopart.com:443/0452003.MRL-Littelfuse-datasheet-150463550.pdf?src-supplier=IHS; ComponentLink1Description: https://datasheet.octopart.com:443/0452003.MRL-Littelfuse-datasheet-150463550.pdf?src-supplier=IHS; ComponentLink2URL: https://datasheet.octopart.com:443/0452003.MRL-Littelfuse-datasheet-128569235.pdf?src-supplier=ODG+(Origin+Data+Global); ComponentLink2Description: https://datasheet.octopart.com:443/0452003.MRL-Littelfuse-datasheet-128569235.pdf?src-supplier=ODG+(Origin+Data+Global); ComponentLink3URL: https://datasheet.octopart.com:443/0452003.MRL-Littelfuse-datasheet-4520.pdf?src-supplier=Farnell; ComponentLink3Description: https://datasheet.octopart.com:443/0452003.MRL-Littelfuse-datasheet-4520.pdf?src-supplier=Farnell; ComponentLink4URL: https://datasheet.octopart.com:443/0452003.MRL-Littelfuse-datasheet-65933515.pdf?src-supplier=Farnell; ComponentLink4Description: https://datasheet.octopart.com:443/0452003.MRL-Littelfuse-datasheet-65933515.pdf?src-supplier=Farnell; ComponentLink5URL: https://datasheet.octopart.com:443/0452003.MRL-Littelfuse-datasheet-71421564.pdf?src-supplier=Farnell; ComponentLink5Description: https://datasheet.octopart.com:443/0452003.MRL-Littelfuse-datasheet-71421564.pdf?src-supplier=Farnell; ComponentLink6URL: https://datasheet.octopart.com:443/0452003.MRL-Littelfuse-datasheet-524166.pdf?src-supplier=Farnell; ComponentLink6Description: https://datasheet.octopart.com:443/0452003.MRL-Littelfuse-datasheet-524166.pdf?src-supplier=Farnell; ComponentLink7URL: https://datasheet.octopart.com:443/0452003.MRL-Littelfuse-datasheet-22975140.pdf?src-supplier=Newark; ComponentLink7Description: https://datasheet.octopart.com:443/0452003.MRL-Littelfuse-datasheet-22975140.pdf?src-supplier=Newark; ComponentLink8URL: https://datasheet.octopart.com:443/0452003.MRL-Littelfuse-datasheet-520781.pdf?src-supplier=TME; ComponentLink8Description: https://datasheet.octopart.com:443/0452003.MRL-Littelfuse-datasheet-520781.pdf?src-supplier=TME; ComponentLink9URL: https://datasheet.octopart.com:443/0452003.MRL-Littelfuse-datasheet-170674127.pdf?src-supplier=JRH+Electronics; ComponentLink9Description: https://datasheet.octopart.com:443/0452003.MRL-Littelfuse-datasheet-170674127.pdf?src-supplier=JRH+Electronics; ComponentLink10URL: https://datasheet.octopart.com:443/0452003.MRL-Littelfuse-datasheet-24577142.pdf?src-supplier=Future+Electronics; ComponentLink10Description: https://datasheet.octopart.com:443/0452003.MRL-Littelfuse-datasheet-24577142.pdf?src-supplier=Future+Electronics; ComponentLink11URL: https://datasheet.octopart.com:443/0452003.MRL-Littelfuse-datasheet-11544861.pdf?src-supplier=Future+Electronics; ComponentLink11Description: https://datasheet.octopart.com:443/0452003.MRL-Littelfuse-datasheet-11544861.pdf?src-supplier=Future+Electronics; ComponentLink12URL: https://datasheet.octopart.com:443/0452003.MRL-Littelfuse-datasheet-8529048.pdf?src-supplier=Future+Electronics; ComponentLink12Description: https://datasheet.octopart.com:443/0452003.MRL-Littelfuse-datasheet-8529048.pdf?src-supplier=Future+Electronics; ComponentLink13URL: https://datasheet.octopart.com:443/0452003.MRL-Littelfuse-datasheet-41168772.pdf?src-supplier=element14+APAC; ComponentLink13Description: https://datasheet.octopart.com:443/0452003.MRL-Littelfuse-datasheet-41168772.pdf?src-supplier=element14+APAC; ComponentLink14URL: https://datasheet.octopart.com:443/0452003.MRL-Littelfuse-datasheet-183575672.pdf?src-supplier=Sager+Electronics; ComponentLink14Description: https://datasheet.octopart.com:443/0452003.MRL-Littelfuse-datasheet-183575672.pdf?src-supplier=Sager+Electronics; ComponentLink15URL: https://datasheet.octopart.com:443/0452003.MRL-Littelfuse-datasheet-43099221.pdf?src-supplier=RS+(Formerly+Allied+Electronics); ComponentLink15Description: https://datasheet.octopart.com:443/0452003.MRL-Littelfuse-datasheet-43099221.pdf?src-supplier=RS+(Formerly+Allied+Electronics); ComponentLink16URL: https://datasheet.octopart.com:443/0452003.MRL-Littelfuse-datasheet-17291148.pdf?src-supplier=Burklin+Elektronik; ComponentLink16Description: https://datasheet.octopart.com:443/0452003.MRL-Littelfuse-datasheet-17291148.pdf?src-supplier=Burklin+Elektronik
F4 F5 = Littelfuse 0452002.MRL: 452 Series - NANO2®Slo-Blo®Subminiature Surface Mount Fuse, 2 A, 125 VAC 125 VDC, RoHS; Approvals: CSA, PSE, UL, UR; Body Material: Ceramic; Ratings: CE, CSA, TUV; Value: 62.5mΩ; Time to Trip: 2ms; Voltage Rating: 125V; Supplier: Farnell; Supplier Part Number: 0452002.MRL; Manufacturer: Littelfuse; Manufacturer Part Number: 0452002.MRL; RoHS: Compliant; Category: Fuses; Stock: 14395; Pricing: 1=2,46, 50=1,56, 100=1,45, 250=1,29, 500=1,24 (EUR); Case/Package: SMD/SMT; China RoHS: Non-Compliant; Contact Plating: Gold; Country of Origin: Philippines; Current Rating: 2A; Depth: 2.69mm; Diameter: 2.69mm; Export Control Classification Number (ECCN) Code: EAR99; Height: 2.69mm; Housing Material: Ceramic; Harmonized Tariff Schedule (HTS) Code: 8536.10.00.40; Introduction Date: 2005-07-31; Lead Free: Lead Free; Length: 6.1mm; Lifecycle Status: Production; Max Operating Temperature: 125°C; Min Operating Temperature: -55°C; Mounting Technology: Surface Mount; Pins: 2; Radiation Hardening: No; REACH SVHC: No; Terminal Material: Gold; Termination: SMD/SMT; Voltage Rating (AC): 125V; Voltage Rating (DC): 125V; Width: 2.69mm; Working Voltage: 125V; ComponentLink1URL: https://datasheet.octopart.com:443/0452002.MRL-Littelfuse-datasheet-150463550.pdf?src-supplier=IHS; ComponentLink1Description: https://datasheet.octopart.com:443/0452002.MRL-Littelfuse-datasheet-150463550.pdf?src-supplier=IHS; ComponentLink2URL: https://datasheet.octopart.com:443/0452002.MRL-Littelfuse-datasheet-24577142.pdf?src-supplier=Upverter; ComponentLink2Description: https://datasheet.octopart.com:443/0452002.MRL-Littelfuse-datasheet-24577142.pdf?src-supplier=Upverter; ComponentLink3URL: https://datasheet.octopart.com:443/0452002.MRL-Littelfuse-datasheet-4520.pdf?src-supplier=Farnell; ComponentLink3Description: https://datasheet.octopart.com:443/0452002.MRL-Littelfuse-datasheet-4520.pdf?src-supplier=Farnell; ComponentLink4URL: https://datasheet.octopart.com:443/0452002.MRL-Littelfuse-datasheet-65933515.pdf?src-supplier=Farnell; ComponentLink4Description: https://datasheet.octopart.com:443/0452002.MRL-Littelfuse-datasheet-65933515.pdf?src-supplier=Farnell; ComponentLink5URL: https://datasheet.octopart.com:443/0452002.MRL-Littelfuse-datasheet-71421564.pdf?src-supplier=Farnell; ComponentLink5Description: https://datasheet.octopart.com:443/0452002.MRL-Littelfuse-datasheet-71421564.pdf?src-supplier=Farnell; ComponentLink6URL: https://datasheet.octopart.com:443/0452002.MRL-Littelfuse-datasheet-524166.pdf?src-supplier=Farnell; ComponentLink6Description: https://datasheet.octopart.com:443/0452002.MRL-Littelfuse-datasheet-524166.pdf?src-supplier=Farnell; ComponentLink7URL: https://datasheet.octopart.com:443/0452002.MRL-Littelfuse-datasheet-22975140.pdf?src-supplier=Newark; ComponentLink7Description: https://datasheet.octopart.com:443/0452002.MRL-Littelfuse-datasheet-22975140.pdf?src-supplier=Newark; ComponentLink8URL: https://datasheet.octopart.com:443/0452002.MRL-Littelfuse-datasheet-11544861.pdf?src-supplier=Factory+Futures; ComponentLink8Description: https://datasheet.octopart.com:443/0452002.MRL-Littelfuse-datasheet-11544861.pdf?src-supplier=Factory+Futures; ComponentLink9URL: https://datasheet.octopart.com:443/0452002.MRL-Littelfuse-datasheet-8529048.pdf?src-supplier=Factory+Futures; ComponentLink9Description: https://datasheet.octopart.com:443/0452002.MRL-Littelfuse-datasheet-8529048.pdf?src-supplier=Factory+Futures; ComponentLink10URL: https://datasheet.octopart.com:443/0452002.MRL-Littelfuse-datasheet-520781.pdf?src-supplier=TME; ComponentLink10Description: https://datasheet.octopart.com:443/0452002.MRL-Littelfuse-datasheet-520781.pdf?src-supplier=TME; ComponentLink11URL: https://datasheet.octopart.com:443/0452002.MRL-Littelfuse-datasheet-170674127.pdf?src-supplier=JRH+Electronics; ComponentLink11Description: https://datasheet.octopart.com:443/0452002.MRL-Littelfuse-datasheet-170674127.pdf?src-supplier=JRH+Electronics; ComponentLink12URL: https://datasheet.octopart.com:443/0452002.MRL-Littelfuse-datasheet-128569235.pdf?src-supplier=ODG+(Origin+Data+Global); ComponentLink12Description: https://datasheet.octopart.com:443/0452002.MRL-Littelfuse-datasheet-128569235.pdf?src-supplier=ODG+(Origin+Data+Global); ComponentLink13URL: https://datasheet.octopart.com:443/0452002.MRL-Littelfuse-datasheet-41168772.pdf?src-supplier=element14+APAC; ComponentLink13Description: https://datasheet.octopart.com:443/0452002.MRL-Littelfuse-datasheet-41168772.pdf?src-supplier=element14+APAC; ComponentLink14URL: https://datasheet.octopart.com:443/0452002.MRL-Littelfuse-datasheet-183575672.pdf?src-supplier=Sager+Electronics; ComponentLink14Description: https://datasheet.octopart.com:443/0452002.MRL-Littelfuse-datasheet-183575672.pdf?src-supplier=Sager+Electronics; ComponentLink15URL: https://datasheet.octopart.com:443/0452002.MRL-Littelfuse-datasheet-43099221.pdf?src-supplier=RS+(Formerly+Allied+Electronics); ComponentLink15Description: https://datasheet.octopart.com:443/0452002.MRL-Littelfuse-datasheet-43099221.pdf?src-supplier=RS+(Formerly+Allied+Electronics); ComponentLink16URL: https://datasheet.octopart.com:443/0452002.MRL-Littelfuse-datasheet-17291148.pdf?src-supplier=Burklin+Elektronik; ComponentLink16Description: https://datasheet.octopart.com:443/0452002.MRL-Littelfuse-datasheet-17291148.pdf?src-supplier=Burklin+Elektronik
F6 = Littelfuse 0452010.MRL: Electric Fuse, Time Lag Blow, 10A, 72VAC, 60VDC, 50A (IR), Surface Mount, NANO; Ratings: CE, CSA, TUV; Time to Trip: 2ms; Voltage Rating (AC): 72V; Voltage Rating (DC): 60V; Supplier: Farnell; Supplier Part Number: 0452010.MRL; Manufacturer: Littelfuse; Manufacturer Part Number: 0452010.MRL; RoHS: Compliant; Category: Fuses; Stock: 195; Pricing: 1=3,24, 50=2,06, 100=1,9, 250=1,71, 500=1,57, 1000=1,46 (EUR); Export Control Classification Number (ECCN) Code: EAR99; Height: 2.69mm; Harmonized Tariff Schedule (HTS) Code: 8536.10.00.40; Introduction Date: 2024-06-26; Length: 6.1mm; Lifecycle Status: Production; Max Operating Temperature: 125°C; Min Operating Temperature: -55°C; Mounting Technology: Surface Mount; REACH SVHC: No; ComponentLink1URL: https://datasheet.octopart.com:443/0452010.MRL-Littelfuse-datasheet-183575671.pdf?src-supplier=Sager+Electronics; ComponentLink1Description: https://datasheet.octopart.com:443/0452010.MRL-Littelfuse-datasheet-183575671.pdf?src-supplier=Sager+Electronics